# EAGLE design CTExciter (EAGLE 6.5.0)
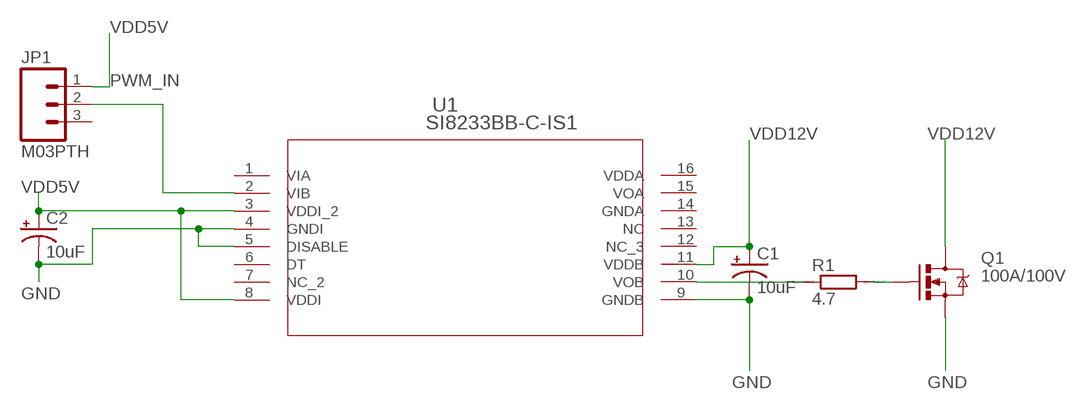
[diagram p0: schematic, sheet 1]

## Parts
C1  10uF  CAP_POLPTH2  [CPOL-RADIAL-10UF-25V]
C2  10uF  CAP_POLPTH2  [CPOL-RADIAL-10UF-25V]
JP1  M03PTH  [1X03]
Q1  100A/100V  MOSFET-NCHANNELPSMN7R0  [TO-263/D2PAK]
R1  4.7  R  [R0805]
U1  SI8233BB-C-IS1  [SOIC-16]

## Nets
GND: C1.2(-) C2.2(-) Q1.3(S) U1.4(GNDI) U1.5(DISABLE) U1.9(GNDB)
N$1: R1.1 U1.10(VOB)
N$2: Q1.1(G) R1.2
PWM_IN: JP1.2 U1.2(VIB)
VDD5V: C2.1(+) JP1.1 U1.3(VDDI_2) U1.8(VDDI)
VDD12V: C1.1(+) Q1.2(D) U1.11(VDDB)
Unconnected: JP1.3 U1.1(VIA) U1.6(DT) U1.7(NC_2) U1.12(NC_3) U1.13(NC) U1.14(GNDA) U1.15(VOA) U1.16(VDDA)

## Library data of the parts
C1 C2 = SensorCape:CAP_POL: Capacitor Polarized These are standard SMD and PTH capacitors. Normally 10uF, 47uF, and 100uF in electrolytic and tantalum varieties. Always verify the external diameter of the through hole cap, it varies with capacity, voltage, and manufacturer. The EIA devices should be standard.
JP1 = SensorCape:M03: Header 3 Standard 3-pin 0.1" header. Use with straight break away headers (SKU : PRT-00116), right angle break away headers (PRT-00553), swiss pins (PRT-00743), machine pins (PRT-00117), and female headers (PRT-00115). Molex polarized connector foot print use with SKU : PRT-08232 with associated crimp pins and housings.
Q1 = SensorCape:MOSFET-NCHANNEL: Common NMOSFET Parts MFG P/N Store ID Prod ID FDD8780 TRANS-09984 SI7820DN TRANS-11055 FDS6630A IC-08089 2N7002PW TRANS-11151 FQP30N06L COM-10213 TRANS-10060 BSS123LT1G TRANS-08345 BSS138 TRANS-00830 BS170 2N7000; PROD_ID: TRANS-12437
R1 = eagle-ltspice:R: RESISTOR, European symbol; SPICEMODEL: NONE; SPICEPREFIX: R
U1 = SensorCape:SI8233BB-C-IS1

## Board
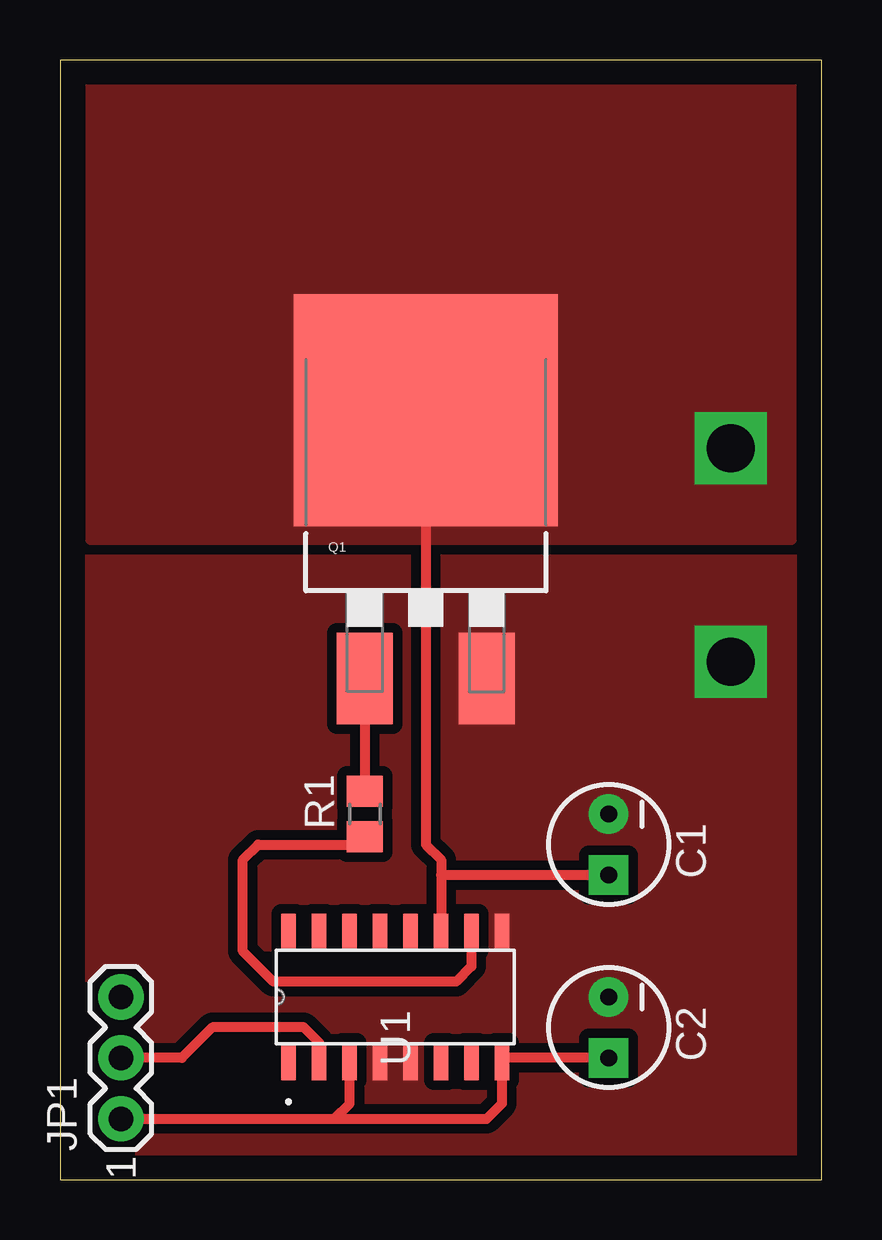
[diagram p1: board, top side]

Size 31.73 x 46.66 mm. Coordinates in mm from the lower left corner, seen from the top.
Outline: 0,0 31.73,0 31.73,46.66 0,46.66 0,0
Copper layers (1*16): Top 0.035mm / dielectric 1.5mm / Bottom 0.035mm
Design rules "default": minimum track width 10mil, minimum drill 24mil, track to track 8mil, track to pad 8mil, pad to pad 8mil, via to via 8mil, smd to smd 8mil, copper to edge 40mil, drill to drill 8mil, minimum pad ring 10mil, minimum via ring 8mil, stop-mask expansion 4mil, vias tented up to drill 0mil, thermal gap 10mil

### Footprints (pad centres in the part's own frame; a part is rotated, then mirrored left to right if it is on the bottom)
CPOL-RADIAL-10UF-25V = drill 0.7 pad 1.651 square: 1 1.27,0 | drill 0.7 pad 1.651: 2 -1.27,0
1X03 = drill 1.016 pad 1.88: 1 -2.54,0; 2 0,0; 3 2.54,0
TO-263/D2PAK = smd 2.32 x 3.81: 1 -2.54,-7.045; 3 2.54,-7.045 | smd 11 x 9.65: 2 0,4.125
R0805 = smd 1.3 x 1.5: 1 -0.95,0; 2 0.95,0
SOIC-16 = smd 1.549 x 0.61: 1 -2.692,4.445; 2 -2.692,3.175; 3 -2.692,1.905; 4 -2.692,0.635; 5 -2.692,-0.635; 6 -2.692,-1.905; 7 -2.692,-3.175; 8 -2.692,-4.445; 9 2.692,-4.445; 10 2.692,-3.175; 11 2.692,-1.905; 12 2.692,-0.635; 13 2.692,0.635; 14 2.692,1.905; 15 2.692,3.175; 16 2.692,4.445

### Placement (x,y rotation side)
C1  22.86,13.97 270 top
C2  22.86,6.35 270 top
JP1  2.54,5.08 90 top
Q1  15.24,27.94 0 top
R1  12.7,15.24 90 top
U1  13.97,7.62 90 top

### Tracks (layer width: path | path; a pad name or v marks a point on that pad's centre or on a via)
GND  (via drill 2)
  other vias: 27.94,21.59
  pour Top (isolate 0.406, rank 4, no thermals): 0,45.72 30.48,45.72 30.48,0 0,0
N$1
  Top 0.406: U1.10 17.14,8.89 16.51,8.26 8.89,8.26 7.62,9.53 7.62,13.34 8.26,13.97 12.38,13.97 R1.1
N$2
  Top 0.406: Q1.1 R1.2
PWM_IN
  Top 0.406: U1.2 10.79,5.71 10.16,6.35 6.35,6.35 5.08,5.08 JP1.2
VDD5V
  Top 0.406: C2.1 18.57,5.08 U1.8 18.41,3.17 17.78,2.54 11.43,2.54 | U1.3 12.06,3.17 11.43,2.54 | JP1.1 11.43,2.54
VDD12V  (via drill 2)
  Top 0.406: Q1.2 15.24,13.97 15.88,13.34 15.88,12.7 | 15.88,12.7 U1.11 | C1.1 15.88,12.7
  other vias: 27.94,30.48
  pour Top (isolate 0.406, no thermals): 1.27,26.67 30.48,26.67 30.48,45.72 1.27,45.72